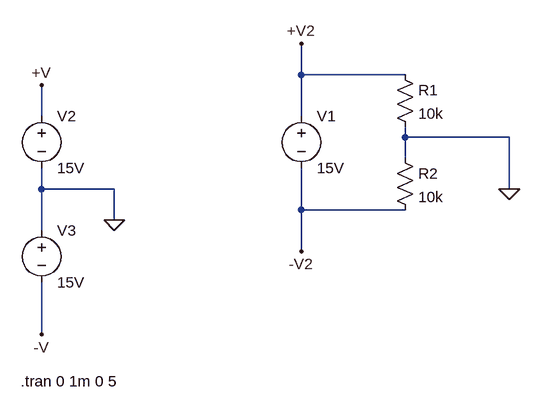
[diagram p0: schematic 25.1_5.(3).asc]
25.1_5.(3).asc, the LTspice schematic file:
Version 4
SHEET 1 880 680
WIRE 336 -16 336 -64
WIRE 496 -16 336 -16
WIRE -64 48 -64 0
WIRE 336 48 336 -16
WIRE 496 80 496 64
WIRE 656 80 496 80
WIRE 496 112 496 80
WIRE -64 160 -64 128
WIRE 48 160 -64 160
WIRE 656 160 656 80
WIRE 336 192 336 128
WIRE 496 192 336 192
WIRE 48 208 48 160
WIRE -64 224 -64 160
WIRE 336 256 336 192
WIRE -64 384 -64 304
FLAG -64 0 +V
FLAG -64 384 -V
FLAG 48 208 0
FLAG 336 -64 +V2
FLAG 336 256 -V2
FLAG 656 160 0
SYMBOL voltage -64 32 R0
WINDOW 123 0 0 Left 2
WINDOW 39 0 0 Left 2
SYMATTR InstName V2
SYMATTR Value 15V
SYMBOL voltage -64 208 R0
WINDOW 123 0 0 Left 2
WINDOW 39 0 0 Left 2
SYMATTR InstName V3
SYMATTR Value 15V
SYMBOL voltage 336 32 R0
WINDOW 123 0 0 Left 2
WINDOW 39 0 0 Left 2
SYMATTR InstName V1
SYMATTR Value 15V
SYMBOL res 480 -32 R0
SYMATTR InstName R1
SYMATTR Value 10k
SYMBOL res 480 96 R0
SYMATTR InstName R2
SYMATTR Value 10k
TEXT -96 456 Left 2 !.tran 0 1m 0 5

The netlist it stands for:
* 25.1_5.(3).asc
V2 +V 0 15V
V3 0 -V 15V
V1 +V2 -V2 15V
R1 +V2 0 10k
R2 0 -V2 10k
.tran 0 1m 0 5
.backanno
.end